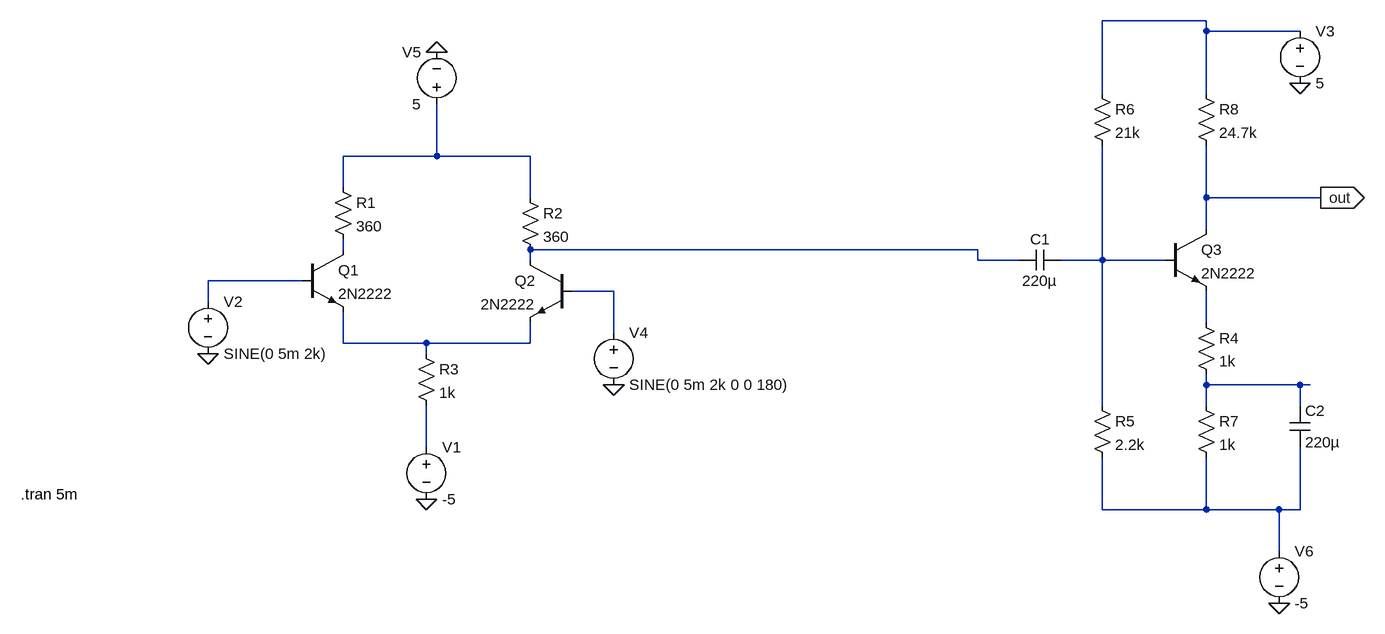
[diagram p0: schematic PREAMP_original_final.asc]
PREAMP_original_final.asc, the LTspice schematic file:
Version 4.1
SHEET 1 2000 712
WIRE 1424 -224 1264 -224
WIRE 1424 -208 1424 -224
WIRE 1568 -208 1424 -208
WIRE 1264 -112 1264 -224
WIRE 1424 -112 1424 -208
WIRE 240 -16 240 -96
WIRE 240 -16 96 -16
WIRE 384 -16 240 -16
WIRE 96 32 96 -16
WIRE 384 48 384 -16
WIRE 1424 48 1424 -32
WIRE 1600 48 1424 48
WIRE 1424 96 1424 48
WIRE 96 128 96 112
WIRE 1072 128 384 128
WIRE 384 144 384 128
WIRE 1072 144 1072 128
WIRE 1136 144 1072 144
WIRE 1264 144 1264 -32
WIRE 1264 144 1200 144
WIRE 1360 144 1264 144
WIRE 32 176 -112 176
WIRE 512 192 448 192
WIRE -112 208 -112 176
WIRE 1424 240 1424 192
WIRE 512 256 512 192
WIRE 96 272 96 224
WIRE 224 272 96 272
WIRE 384 272 384 240
WIRE 384 272 224 272
WIRE 224 288 224 272
WIRE 1424 336 1424 320
WIRE 1568 336 1424 336
WIRE 1584 336 1568 336
WIRE 1264 368 1264 144
WIRE 1424 368 1424 336
WIRE 1568 368 1568 336
WIRE 224 432 224 368
WIRE 1264 528 1264 448
WIRE 1424 528 1424 448
WIRE 1424 528 1264 528
WIRE 1536 528 1424 528
WIRE 1568 528 1568 432
WIRE 1568 528 1536 528
WIRE 1536 592 1536 528
FLAG 224 512 0
FLAG 1568 -128 0
FLAG 1536 672 0
FLAG 240 -176 0
FLAG -112 288 0
FLAG 512 336 0
FLAG 1600 48 out
IOPIN 1600 48 Out
SYMBOL npn 32 128 R0
SYMATTR InstName Q1
SYMATTR Value 2N2222
SYMBOL npn 448 144 M0
SYMATTR InstName Q2
SYMATTR Value 2N2222
SYMBOL res 80 16 R0
SYMATTR InstName R1
SYMATTR Value 360
SYMBOL res 368 32 R0
SYMATTR InstName R2
SYMATTR Value 360
SYMBOL res 208 272 R0
SYMATTR InstName R3
SYMATTR Value 1k
SYMBOL voltage 224 416 R0
WINDOW 123 0 0 Left 0
WINDOW 39 0 0 Left 0
SYMATTR InstName V1
SYMATTR Value -5
SYMBOL npn 1360 96 R0
SYMATTR InstName Q3
SYMATTR Value 2N2222
SYMBOL res 1248 352 R0
SYMATTR InstName R5
SYMATTR Value 2.2k
SYMBOL res 1248 -128 R0
SYMATTR InstName R6
SYMATTR Value 21k
SYMBOL res 1408 -128 R0
SYMATTR InstName R8
SYMATTR Value 24.7k
SYMBOL voltage 1568 -224 R0
WINDOW 123 0 0 Left 0
WINDOW 39 0 0 Left 0
SYMATTR InstName V3
SYMATTR Value 5
SYMBOL voltage 1536 576 R0
WINDOW 123 0 0 Left 0
WINDOW 39 0 0 Left 0
SYMATTR InstName V6
SYMATTR Value -5
SYMBOL voltage -112 192 R0
WINDOW 123 0 0 Left 0
WINDOW 39 0 0 Left 0
SYMATTR InstName V2
SYMATTR Value SINE(0 5m 2k)
SYMBOL voltage 512 240 R0
WINDOW 123 0 0 Left 0
WINDOW 39 0 0 Left 0
SYMATTR InstName V4
SYMATTR Value SINE(0 5m 2k 0 0 180)
SYMBOL voltage 240 -80 R180
WINDOW 0 24 96 Left 2
WINDOW 3 24 16 Left 2
WINDOW 123 0 0 Left 0
WINDOW 39 0 0 Left 0
SYMATTR InstName V5
SYMATTR Value 5
SYMBOL cap 1200 128 R90
WINDOW 0 0 32 VBottom 2
WINDOW 3 32 32 VTop 2
SYMATTR InstName C1
SYMATTR Value 220µ
SYMBOL res 1408 224 R0
SYMATTR InstName R4
SYMATTR Value 1k
SYMBOL res 1408 352 R0
SYMATTR InstName R7
SYMATTR Value 1k
SYMBOL cap 1552 368 R0
SYMATTR InstName C2
SYMATTR Value 220µ
TEXT -400 504 Left 2 !.tran 5m

The netlist it stands for:
* PREAMP_original_final.asc
Q1 N003 N006 N009 0 2N2222
Q2 N004 N007 N009 0 2N2222
R1 N002 N003 360
R2 N002 N004 360
R3 N009 N011 1k
V1 N011 0 -5
Q3 out N005 N008 0 2N2222
R5 N005 N012 2.2k
R6 N001 N005 21k
R8 N001 out 24.7k
V3 N001 0 5
V6 N012 0 -5
V2 N006 0 SINE(0 5m 2k)
V4 N007 0 SINE(0 5m 2k 0 0 180)
V5 N002 0 5
C1 N005 N004 220µ
R4 N008 N010 1k
R7 N010 N012 1k
C2 N010 N012 220µ
.model NPN NPN
.model PNP PNP
.lib standard.bjt
.tran 5m
.backanno
.end